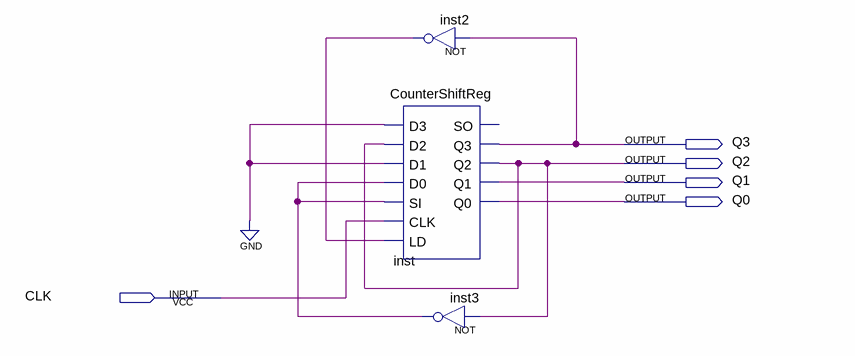
[diagram p0: schematic sheet]
// Quartus schematic CounterShiftRegDemo2.bdf as structural Verilog: 3 symbols, 5 pins
module CounterShiftRegDemo2 (
  input  CLK,
  output Q3,
  output Q2,
  output Q1,
  output Q0
);

  wire inst2_out, inst3_out;

  not inst2 (inst2_out, Q3);
  CounterShiftReg inst (
    .D3(1'b0), .D2(Q2), .D1(1'b0), .D0(inst3_out), .SI(inst3_out), .CLK(CLK), .LD(inst2_out), .Q3(Q3),
    .Q2(Q2), .Q1(Q1), .Q0(Q0));  // open: SO
  not inst3 (inst3_out, Q2);
endmodule
